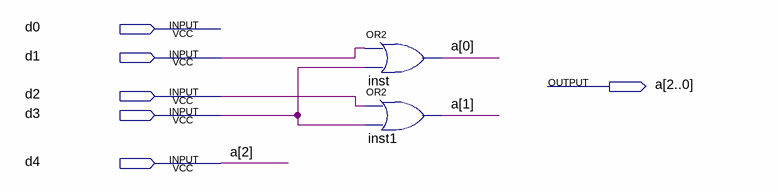
[diagram p0: schematic sheet]
// Quartus schematic cod53.bdf as structural Verilog: 2 symbols, 6 pins
module cod53 (
  input  d0,
  input  d1,
  input  d2,
  input  d3,
  input  d4,
  output [2:0] a
);

  or inst (a[0], d1, d3);
  or inst1 (a[1], d2, d3);

  assign a[2] = d4;
endmodule
